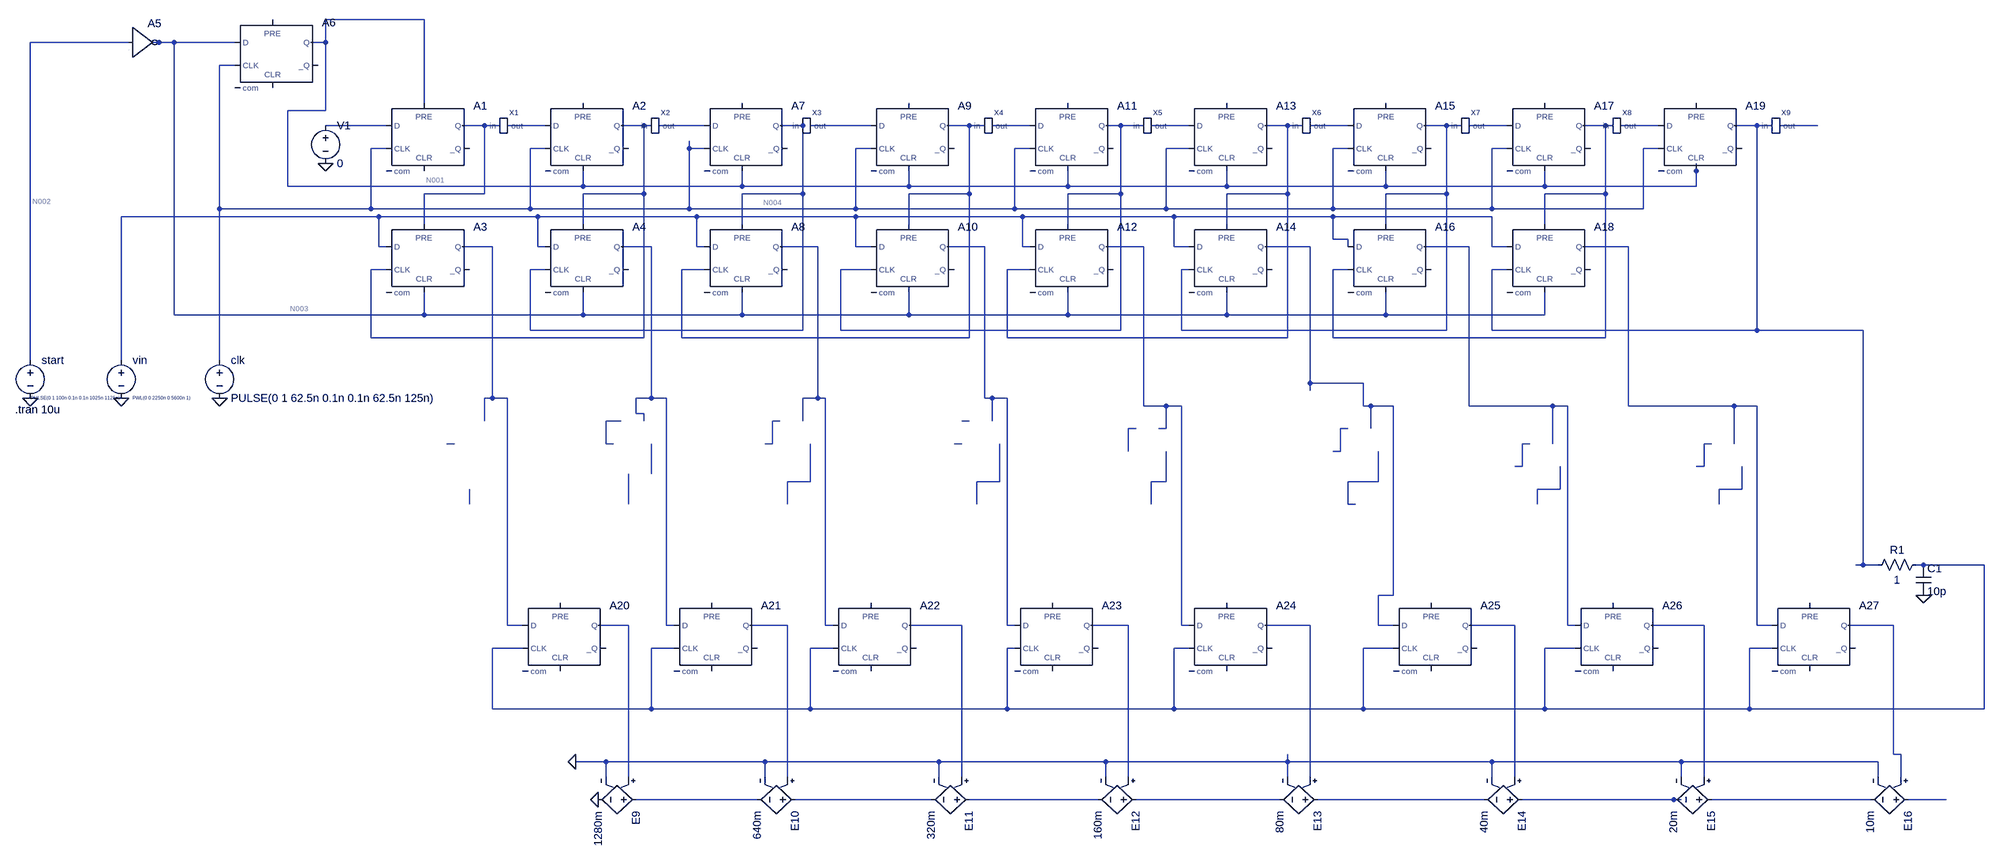
[diagram p0: schematic Draft7.asc]
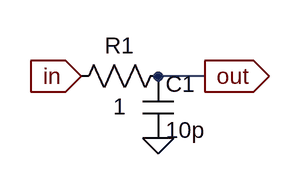
[diagram p1: sub-circuit rc_delay.asc]
Draft7.asc, the LTspice schematic file:
Version 4
SHEET 1 3496 1640
WIRE 144 -112 -64 -112
WIRE -480 -64 -688 -64
WIRE -416 -64 -432 -64
WIRE -384 -64 -416 -64
WIRE -256 -64 -384 -64
WIRE -64 -64 -64 -112
WIRE -64 -64 -96 -64
WIRE -256 -16 -288 -16
WIRE 144 64 144 -112
WIRE -64 80 -64 -64
WIRE -64 80 -144 80
WIRE 64 112 -64 112
WIRE 272 112 224 112
WIRE 304 112 272 112
WIRE 400 112 320 112
WIRE 608 112 560 112
WIRE 624 112 608 112
WIRE 736 112 640 112
WIRE 944 112 896 112
WIRE 1088 112 960 112
WIRE 1296 112 1248 112
WIRE 1328 112 1296 112
WIRE 1424 112 1344 112
WIRE 1616 112 1584 112
WIRE 1664 112 1616 112
WIRE 1760 112 1680 112
WIRE 1968 112 1920 112
WIRE 2000 112 1968 112
WIRE 2096 112 2016 112
WIRE 2304 112 2256 112
WIRE 2336 112 2304 112
WIRE 2432 112 2352 112
WIRE 2640 112 2592 112
WIRE 2656 112 2640 112
WIRE 2752 112 2672 112
WIRE 2960 112 2912 112
WIRE 2992 112 2960 112
WIRE 3088 112 3008 112
WIRE 64 160 32 160
WIRE 400 160 368 160
WIRE 704 160 704 144
WIRE 736 160 704 160
WIRE 1088 160 1056 160
WIRE 1424 160 1392 160
WIRE 1760 160 1712 160
WIRE 2096 160 2064 160
WIRE 2432 160 2400 160
WIRE 2752 160 2720 160
WIRE 2832 208 2832 192
WIRE -144 240 -144 80
WIRE 480 240 480 208
WIRE 480 240 -144 240
WIRE 816 240 816 208
WIRE 816 240 480 240
WIRE 1168 240 1168 208
WIRE 1168 240 816 240
WIRE 1504 240 1504 208
WIRE 1504 240 1168 240
WIRE 1840 240 1840 208
WIRE 1840 240 1504 240
WIRE 2176 240 2176 208
WIRE 2176 240 1840 240
WIRE 2512 240 2512 208
WIRE 2512 240 2176 240
WIRE 2832 240 2832 208
WIRE 2832 240 2512 240
WIRE 272 256 272 112
WIRE 272 256 144 256
WIRE 608 256 608 112
WIRE 608 256 480 256
WIRE 944 256 944 112
WIRE 944 256 816 256
WIRE 1296 256 1296 112
WIRE 1296 256 1168 256
WIRE 1616 256 1616 112
WIRE 1616 256 1504 256
WIRE 1968 256 1968 112
WIRE 1968 256 1840 256
WIRE 2304 256 2304 112
WIRE 2304 256 2176 256
WIRE 2640 256 2640 112
WIRE 2640 256 2512 256
WIRE -288 288 -288 -16
WIRE 32 288 32 160
WIRE 32 288 -288 288
WIRE 368 288 368 160
WIRE 368 288 32 288
WIRE 704 288 704 160
WIRE 704 288 368 288
WIRE 1056 288 1056 160
WIRE 1056 288 704 288
WIRE 1392 288 1392 160
WIRE 1392 288 1056 288
WIRE 1712 288 1712 160
WIRE 1712 288 1392 288
WIRE 2064 288 2064 160
WIRE 2064 288 1712 288
WIRE 2400 288 2400 160
WIRE 2400 288 2064 288
WIRE 2720 288 2720 160
WIRE 2720 288 2400 288
WIRE 48 304 -496 304
WIRE 384 304 48 304
WIRE 720 304 384 304
WIRE 1056 304 720 304
WIRE 1408 304 1056 304
WIRE 1728 304 1408 304
WIRE 2064 304 1728 304
WIRE 2400 304 2064 304
WIRE 144 320 144 256
WIRE 480 320 480 256
WIRE 816 320 816 256
WIRE 1168 320 1168 256
WIRE 1504 320 1504 256
WIRE 1840 320 1840 256
WIRE 2176 320 2176 256
WIRE 2512 320 2512 256
WIRE 2064 352 2064 304
WIRE 2096 352 2064 352
WIRE 48 368 48 304
WIRE 64 368 48 368
WIRE 288 368 224 368
WIRE 384 368 384 304
WIRE 400 368 384 368
WIRE 624 368 560 368
WIRE 720 368 720 304
WIRE 736 368 720 368
WIRE 976 368 896 368
WIRE 1056 368 1056 304
WIRE 1088 368 1056 368
WIRE 1328 368 1248 368
WIRE 1408 368 1408 304
WIRE 1424 368 1408 368
WIRE 1664 368 1584 368
WIRE 1728 368 1728 304
WIRE 1760 368 1728 368
WIRE 2016 368 1920 368
WIRE 2096 368 2096 352
WIRE 2352 368 2256 368
WIRE 2400 368 2400 304
WIRE 2432 368 2400 368
WIRE 2688 368 2592 368
WIRE 64 416 32 416
WIRE 400 416 368 416
WIRE 736 416 688 416
WIRE 1088 416 1024 416
WIRE 1424 416 1376 416
WIRE 1760 416 1744 416
WIRE 2096 416 2064 416
WIRE 2432 416 2400 416
WIRE -384 512 -384 -64
WIRE 144 512 144 464
WIRE 144 512 -384 512
WIRE 480 512 480 464
WIRE 480 512 144 512
WIRE 816 512 816 464
WIRE 816 512 480 512
WIRE 1168 512 1168 464
WIRE 1168 512 816 512
WIRE 1504 512 1504 464
WIRE 1504 512 1168 512
WIRE 1840 512 1840 464
WIRE 1840 512 1504 512
WIRE 2176 512 2176 464
WIRE 2176 512 1840 512
WIRE 2512 512 2512 464
WIRE 2512 512 2176 512
WIRE 368 544 368 416
WIRE 944 544 944 256
WIRE 944 544 368 544
WIRE 1024 544 1024 416
WIRE 1616 544 1616 256
WIRE 1616 544 1024 544
WIRE 1744 544 1744 416
WIRE 2304 544 2304 256
WIRE 2304 544 1744 544
WIRE 2400 544 2400 416
WIRE 2960 544 2960 112
WIRE 2960 544 2400 544
WIRE 3184 544 2960 544
WIRE 32 560 32 416
WIRE 608 560 608 256
WIRE 608 560 32 560
WIRE 688 560 688 416
WIRE 1296 560 1296 256
WIRE 1296 560 688 560
WIRE 1376 560 1376 416
WIRE 1968 560 1968 256
WIRE 1968 560 1376 560
WIRE 2064 560 2064 416
WIRE 2640 560 2640 256
WIRE 2640 560 2064 560
WIRE -688 608 -688 -64
WIRE -496 608 -496 304
WIRE -288 608 -288 288
WIRE 2016 656 2016 368
WIRE 2128 656 2016 656
WIRE 2016 672 2016 656
WIRE 288 688 288 368
WIRE 288 688 272 688
WIRE 320 688 288 688
WIRE 624 688 624 368
WIRE 624 688 592 688
WIRE 656 688 624 688
WIRE 976 688 976 368
WIRE 976 688 944 688
WIRE 992 688 976 688
WIRE 1328 688 1328 368
WIRE 1344 688 1328 688
WIRE 1376 688 1344 688
WIRE 1664 704 1664 368
WIRE 1712 704 1664 704
WIRE 1744 704 1712 704
WIRE 2128 704 2128 656
WIRE 2144 704 2128 704
WIRE 2192 704 2144 704
WIRE 2352 704 2352 368
WIRE 2528 704 2352 704
WIRE 2560 704 2528 704
WIRE 2688 704 2688 368
WIRE 2912 704 2688 704
WIRE 2960 704 2912 704
WIRE 592 720 592 688
WIRE 608 720 592 720
WIRE 272 736 272 688
WIRE 560 736 528 736
WIRE 608 736 608 720
WIRE 896 736 880 736
WIRE 944 736 944 688
WIRE 1296 736 1280 736
WIRE 1344 736 1344 688
WIRE 1648 752 1632 752
WIRE 1712 752 1712 704
WIRE 1712 752 1696 752
WIRE 2096 752 2080 752
WIRE 2144 752 2144 704
WIRE 208 784 192 784
WIRE 528 784 528 736
WIRE 544 784 528 784
WIRE 880 784 880 736
WIRE 880 784 864 784
WIRE 1280 784 1264 784
WIRE 2480 784 2464 784
WIRE 2528 784 2528 704
WIRE 2864 784 2848 784
WIRE 2912 784 2912 704
WIRE 1632 800 1632 752
WIRE 2080 800 2080 752
WIRE 2080 800 2064 800
WIRE 2464 832 2464 784
WIRE 2464 832 2448 832
WIRE 2848 832 2848 784
WIRE 2848 832 2832 832
WIRE 624 848 624 784
WIRE 960 864 960 784
WIRE 960 864 912 864
WIRE 1360 864 1360 784
WIRE 1360 864 1312 864
WIRE 1712 864 1712 800
WIRE 1712 864 1680 864
WIRE 2160 864 2160 800
WIRE 2160 864 2096 864
WIRE 2544 880 2544 832
WIRE 2544 880 2496 880
WIRE 2928 880 2928 832
WIRE 2928 880 2880 880
WIRE 240 912 240 880
WIRE 576 912 576 848
WIRE 912 912 912 864
WIRE 1312 912 1312 864
WIRE 1680 912 1680 864
WIRE 2096 912 2096 864
WIRE 2112 912 2096 912
WIRE 2496 912 2496 880
WIRE 2880 912 2880 880
WIRE 3184 1040 3184 544
WIRE 3184 1040 3168 1040
WIRE 3216 1040 3184 1040
WIRE 3312 1040 3296 1040
WIRE 3440 1040 3312 1040
WIRE 2192 1104 2192 704
WIRE 2192 1104 2160 1104
WIRE 320 1168 320 688
WIRE 352 1168 320 1168
WIRE 576 1168 512 1168
WIRE 656 1168 656 688
WIRE 672 1168 656 1168
WIRE 912 1168 832 1168
WIRE 992 1168 992 688
WIRE 1008 1168 992 1168
WIRE 1280 1168 1168 1168
WIRE 1376 1168 1376 688
WIRE 1392 1168 1376 1168
WIRE 1632 1168 1552 1168
WIRE 1744 1168 1744 704
WIRE 1760 1168 1744 1168
WIRE 2016 1168 1920 1168
WIRE 2160 1168 2160 1104
WIRE 2192 1168 2160 1168
WIRE 2448 1168 2352 1168
WIRE 2560 1168 2560 704
WIRE 2576 1168 2560 1168
WIRE 2848 1168 2736 1168
WIRE 2960 1168 2960 704
WIRE 2992 1168 2960 1168
WIRE 3248 1168 3152 1168
WIRE 352 1216 288 1216
WIRE 672 1216 624 1216
WIRE 1008 1216 960 1216
WIRE 1392 1216 1376 1216
WIRE 1760 1216 1728 1216
WIRE 2192 1216 2128 1216
WIRE 2576 1216 2512 1216
WIRE 2992 1216 2944 1216
WIRE 288 1344 288 1216
WIRE 624 1344 624 1216
WIRE 624 1344 288 1344
WIRE 960 1344 960 1216
WIRE 960 1344 624 1344
WIRE 1376 1344 1376 1216
WIRE 1376 1344 960 1344
WIRE 1728 1344 1728 1216
WIRE 1728 1344 1376 1344
WIRE 2128 1344 2128 1216
WIRE 2128 1344 1728 1344
WIRE 2512 1344 2512 1216
WIRE 2512 1344 2128 1344
WIRE 2944 1344 2944 1216
WIRE 2944 1344 2512 1344
WIRE 3440 1344 3440 1040
WIRE 3440 1344 2944 1344
WIRE 3248 1440 3248 1168
WIRE 3264 1440 3248 1440
WIRE 528 1456 464 1456
WIRE 864 1456 528 1456
WIRE 1232 1456 864 1456
WIRE 1584 1456 1232 1456
WIRE 1968 1456 1968 1440
WIRE 1968 1456 1584 1456
WIRE 2400 1456 1968 1456
WIRE 2800 1456 2400 1456
WIRE 3216 1456 2800 1456
WIRE 528 1488 528 1456
WIRE 576 1488 576 1168
WIRE 864 1488 864 1456
WIRE 912 1488 912 1168
WIRE 1232 1488 1232 1456
WIRE 1280 1488 1280 1168
WIRE 1584 1488 1584 1456
WIRE 1632 1488 1632 1168
WIRE 1968 1488 1968 1456
WIRE 2016 1488 2016 1168
WIRE 2400 1488 2400 1456
WIRE 2448 1488 2448 1168
WIRE 2800 1488 2800 1456
WIRE 2848 1488 2848 1168
WIRE 3216 1488 3216 1456
WIRE 3264 1488 3264 1440
WIRE 848 1536 592 1536
WIRE 1216 1536 928 1536
WIRE 1568 1536 1296 1536
WIRE 1952 1536 1648 1536
WIRE 2384 1536 2032 1536
WIRE 2784 1536 2464 1536
WIRE 2800 1536 2784 1536
WIRE 3200 1536 2864 1536
WIRE 3360 1536 3280 1536
FLAG -688 688 0
FLAG -496 688 0
FLAG -288 688 0
FLAG -64 192 0
FLAG 464 1456 0
FLAG 512 1536 0
FLAG 3312 1104 0
SYMBOL Digital\\dflop 144 64 R0
SYMATTR InstName A1
SYMBOL Digital\\dflop 480 64 R0
SYMATTR InstName A2
SYMBOL Digital\\dflop 144 320 R0
SYMATTR InstName A3
SYMBOL Digital\\dflop 480 320 R0
SYMATTR InstName A4
SYMBOL voltage -64 96 R0
WINDOW 123 0 0 Left 0
WINDOW 39 0 0 Left 0
SYMATTR InstName V1
SYMATTR Value 0
SYMBOL voltage -688 592 R0
WINDOW 3 94 102 Bottom 0
WINDOW 123 0 0 Left 0
WINDOW 39 0 0 Left 0
SYMATTR Value PULSE(0 1 100n 0.1n 0.1n 1025n 1125n)
SYMATTR InstName start
SYMBOL voltage -496 592 R0
WINDOW 123 0 0 Left 0
WINDOW 39 0 0 Left 0
WINDOW 3 24 96 Left 0
SYMATTR Value PWL(0 0 2250n 0 5600n 1)
SYMATTR InstName vin
SYMBOL voltage -288 592 R0
WINDOW 123 0 0 Left 0
WINDOW 39 0 0 Left 0
SYMATTR InstName clk
SYMATTR Value PULSE(0 1 62.5n 0.1n 0.1n 62.5n 125n)
SYMBOL Digital\\inv -480 -128 R0
SYMATTR InstName A5
SYMBOL Digital\\dflop -176 -112 R0
SYMATTR InstName A6
SYMBOL rc_delay 304 96 R0
SYMATTR InstName X1
SYMBOL Digital\\dflop 816 64 R0
SYMATTR InstName A7
SYMBOL rc_delay 624 96 R0
SYMATTR InstName X2
SYMBOL Digital\\dflop 816 320 R0
SYMATTR InstName A8
SYMBOL Digital\\dflop 1168 64 R0
SYMATTR InstName A9
SYMBOL Digital\\dflop 1168 320 R0
SYMATTR InstName A10
SYMBOL Digital\\dflop 1504 64 R0
SYMATTR InstName A11
SYMBOL Digital\\dflop 1504 320 R0
SYMATTR InstName A12
SYMBOL Digital\\dflop 1840 64 R0
SYMATTR InstName A13
SYMBOL Digital\\dflop 1840 320 R0
SYMATTR InstName A14
SYMBOL Digital\\dflop 2176 64 R0
SYMATTR InstName A15
SYMBOL Digital\\dflop 2176 320 R0
SYMATTR InstName A16
SYMBOL Digital\\dflop 2512 64 R0
SYMATTR InstName A17
SYMBOL Digital\\dflop 2512 320 R0
SYMATTR InstName A18
SYMBOL Digital\\dflop 2832 64 R0
SYMATTR InstName A19
SYMBOL rc_delay 944 96 R0
SYMATTR InstName X3
SYMBOL rc_delay 1328 96 R0
SYMATTR InstName X4
SYMBOL rc_delay 1664 96 R0
SYMATTR InstName X5
SYMBOL rc_delay 2000 96 R0
SYMATTR InstName X6
SYMBOL rc_delay 2336 96 R0
SYMATTR InstName X7
SYMBOL rc_delay 2656 96 R0
SYMATTR InstName X8
SYMBOL rc_delay 2992 96 R0
SYMATTR InstName X9
SYMBOL Digital\\dflop 432 1120 R0
SYMATTR InstName A20
SYMBOL Digital\\dflop 752 1120 R0
SYMATTR InstName A21
SYMBOL Digital\\dflop 1088 1120 R0
SYMATTR InstName A22
SYMBOL Digital\\dflop 1472 1120 R0
SYMATTR InstName A23
SYMBOL Digital\\dflop 1840 1120 R0
SYMATTR InstName A24
SYMBOL Digital\\dflop 2272 1120 R0
SYMATTR InstName A25
SYMBOL Digital\\dflop 2656 1120 R0
SYMATTR InstName A26
SYMBOL Digital\\dflop 3072 1120 R0
SYMATTR InstName A27
SYMBOL e 608 1536 R90
SYMATTR InstName E9
SYMATTR Value 1280m
SYMBOL e 944 1536 R90
SYMATTR InstName E10
SYMATTR Value 640m
SYMBOL e 1312 1536 R90
SYMATTR InstName E11
SYMATTR Value 320m
SYMBOL e 1664 1536 R90
SYMATTR InstName E12
SYMATTR Value 160m
SYMBOL e 2048 1536 R90
SYMATTR InstName E13
SYMATTR Value 80m
SYMBOL e 2480 1536 R90
SYMATTR InstName E14
SYMATTR Value 40m
SYMBOL e 2880 1536 R90
SYMATTR InstName E15
SYMATTR Value 20m
SYMBOL e 3296 1536 R90
SYMATTR InstName E16
SYMATTR Value 10m
SYMBOL res 3312 1024 R90
WINDOW 0 0 56 VBottom 2
WINDOW 3 32 56 VTop 2
SYMATTR InstName R1
SYMATTR Value 1
SYMBOL cap 3296 1040 R0
SYMATTR InstName C1
SYMATTR Value 10p
TEXT -720 712 Left 2 !.tran 10u

rc_delay.asc, the sub-circuit schematic file:
Version 4
SHEET 1 880 680
WIRE 272 160 224 160
FLAG 144 160 in
IOPIN 144 160 In
FLAG 272 160 out
IOPIN 272 160 Out
FLAG 224 224 0
SYMBOL res 240 144 R90
WINDOW 0 0 56 VBottom 2
WINDOW 3 32 56 VTop 2
SYMATTR InstName R1
SYMATTR Value 1
SYMBOL cap 208 160 R0
SYMATTR InstName C1
SYMATTR Value 10p

The netlist it stands for:
* Draft7.asc
A1 N005 0 N004 N001 0 0 N006 0 DFLOP
A2 N007 0 N004 0 N001 0 N008 0 DFLOP
A3 N024 0 N008 N006 N003 0 N025 0 DFLOP
A4 N024 0 N010 N008 N003 0 N026 0 DFLOP
V1 N005 0 0
V§start N002 0 PULSE(0 1 100n 0.1n 0.1n 1025n 1125n)
vin N024 0 PWL(0 0 2250n 0 5600n 1)
V§clk N004 0 PULSE(0 1 62.5n 0.1n 0.1n 62.5n 125n)
A5 N002 0 0 0 0 N003 0 0 BUF
A6 N003 0 N004 0 0 0 N001 0 DFLOP
XX1 N006 N007 rc_delay
A7 N009 0 N004 0 N001 0 N010 0 DFLOP
XX2 N008 N009 rc_delay
A8 N024 0 N012 N010 N003 0 N027 0 DFLOP
A9 N011 0 N004 0 N001 0 N012 0 DFLOP
A10 N024 0 N014 N012 N003 0 N028 0 DFLOP
A11 N013 0 N004 0 N001 0 N014 0 DFLOP
A12 N024 0 N016 N014 N003 0 N029 0 DFLOP
A13 N015 0 N004 0 N001 0 N016 0 DFLOP
A14 N024 0 N018 N016 N003 0 N030 0 DFLOP
A15 N017 0 N004 0 N001 0 N018 0 DFLOP
A16 N024 0 N020 N018 N003 0 N031 0 DFLOP
A17 N019 0 N004 0 N001 0 N020 0 DFLOP
A18 N024 0 N022 N020 N003 0 N032 0 DFLOP
A19 N021 0 N004 0 N001 0 N022 0 DFLOP
XX3 N010 N011 rc_delay
XX4 N012 N013 rc_delay
XX5 N014 N015 rc_delay
XX6 N016 N017 rc_delay
XX7 N018 N019 rc_delay
XX8 N020 N021 rc_delay
XX9 N022 N023 rc_delay
A20 N025 0 N051 0 0 0 N052 0 DFLOP
A21 N026 0 N051 0 0 0 N053 0 DFLOP
A22 N027 0 N051 0 0 0 N054 0 DFLOP
A23 N028 0 N051 0 0 0 N055 0 DFLOP
A24 N029 0 N051 0 0 0 N056 0 DFLOP
A25 N030 0 N051 0 0 0 N057 0 DFLOP
A26 N031 0 N051 0 0 0 N058 0 DFLOP
A27 N032 0 N051 0 0 0 N059 0 DFLOP
E9 N060 0 N052 0 1280m
E10 N061 N060 N053 0 640m
E11 N062 N061 N054 0 320m
E12 N063 N062 N055 0 160m
E13 N064 N063 N056 0 80m
E14 N065 N064 N057 0 40m
E15 N066 N065 N058 0 20m
E16 N067 N066 N059 0 10m
R1 N051 N022 1
C1 N051 0 10p

* block symbol definitions
.subckt rc_delay in out
R1 out in 1
C1 out 0 10p
.ends rc_delay

.tran 10u
.backanno
.end

* Results of the author's LTspice run, read from the files saved beside the schematic
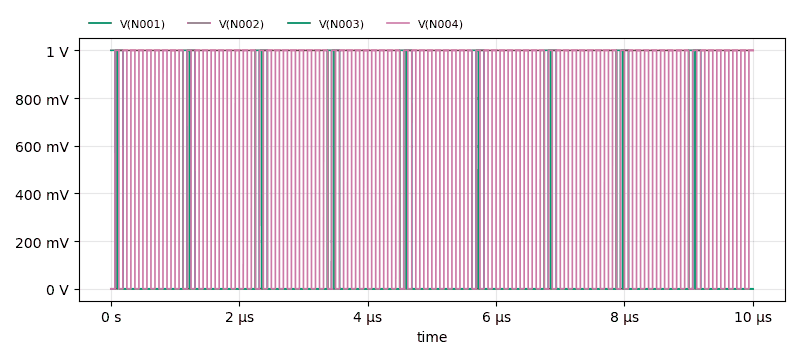
[diagram p2: Transient Analysis of Draft7.asc, plotted from the saved traces]
* Transient Analysis, 1 run:
*   V(N001): min 0 V, max 1 V, average 112.5 mV, rms 335.4 mV, last 0 V
*   V(N002): min 0 V, max 1 V, average 910.1 mV, rms 954 mV, last 1 V
*   V(N003): min 0 V, max 1 V, average 89.93 mV, rms 299.9 mV, last 0 V
*   V(N004): min 0 V, max 1 V, average 500.7 mV, rms 707.4 mV, last 1 V